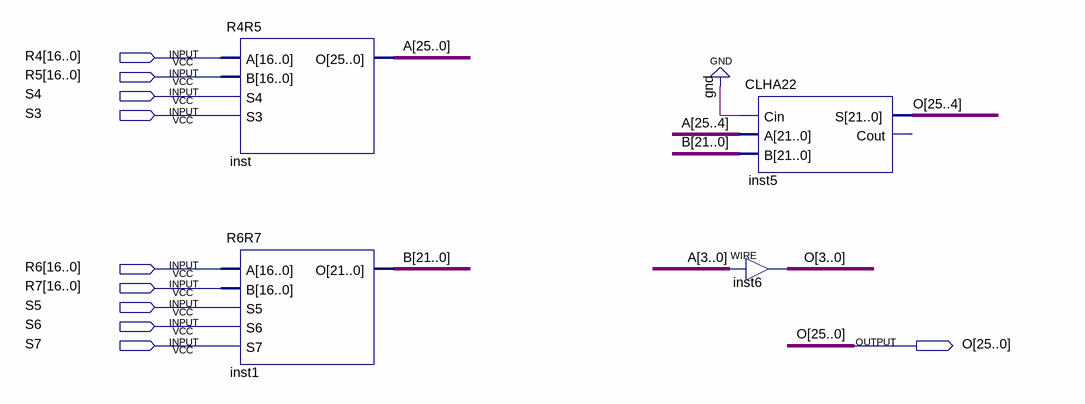
[diagram p0: schematic sheet]
// Quartus schematic R4567.bdf as structural Verilog: 4 symbols, 10 pins
module R4567 (
  input  [16:0] R4,
  input  [16:0] R5,
  input  S4,
  input  S3,
  input  [16:0] R6,
  input  [16:0] R7,
  input  S5,
  input  S6,
  input  S7,
  output [25:0] O
);

  wire [21:0] B;
  wire [25:0] A;

  R4R5 inst (.A(R4), .B(R5), .S4(S4), .S3(S3), .O(A));
  R6R7 inst1 (.A(R6), .B(R7), .S5(S5), .S6(S6), .S7(S7), .O(B));
  CLHA22 inst5 (.Cin(1'b0), .A(A[25:4]), .B(B), .S(O[25:4]));  // open: Cout
  assign O[3:0] = A[3:0];  // WIRE inst6
endmodule
